# EAGLE design E2_Transistor_Blank (EAGLE 9.3.0)
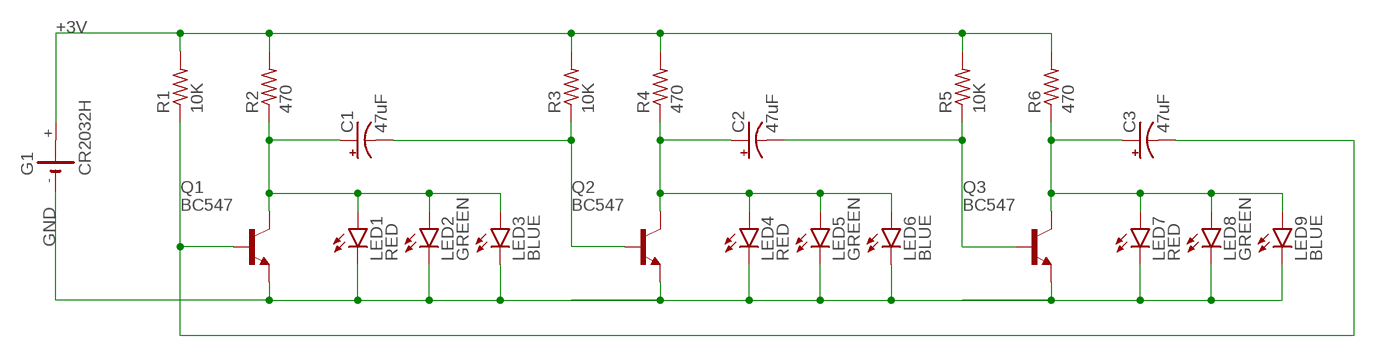
[diagram p0: schematic, sheet 1]

## Parts
C1  47uF  CPOL-USE1.8-4  [E1,8-4]
C2  47uF  CPOL-USE1.8-4  [E1,8-4]
C3  47uF  CPOL-USE1.8-4  [E1,8-4]
G1  CR2032H  [CR2032H]
LED1  RED  LED5MM  [LED5MM]
LED2  GREEN  LED5MM  [LED5MM]
LED3  BLUE  LED5MM  [LED5MM]
LED4  RED  LED5MM  [LED5MM]
LED5  GREEN  LED5MM  [LED5MM]
LED6  BLUE  LED5MM  [LED5MM]
LED7  RED  LED5MM  [LED5MM]
LED8  GREEN  LED5MM  [LED5MM]
LED9  BLUE  LED5MM  [LED5MM]
Q1  BC547  [TO92]
Q2  BC547  [TO92]
Q3  BC547  [TO92]
R1  10K  R-US_0309/12  [0309/12]
R2  470  R-US_0309/12  [0309/12]
R3  10K  R-US_0309/12  [0309/12]
R4  470  R-US_0309/12  [0309/12]
R5  10K  R-US_0309/12  [0309/12]
R6  470  R-US_0309/12  [0309/12]

## Nets
+3V: G1.+ R1.2 R2.2 R3.2 R4.2 R5.2 R6.2
GND: G1.- LED1.K(C) LED2.K(C) LED3.K(C) LED4.K(C) LED5.K(C) LED6.K(C) LED7.K(C) LED8.K(C) LED9.K(C) Q1.1(E) Q2.1(E) Q3.1(E)
N$1: C1.+ LED1.A LED2.A LED3.A Q1.3(C) R2.1
N$4: C1.- Q2.2(B) R3.1
N$6: C2.+ LED4.A LED5.A LED6.A Q2.3(C) R4.1
N$7: C3.+ LED7.A LED8.A LED9.A Q3.3(C) R6.1
N$8: C3.- Q1.2(B) R1.1
N$9: C2.- Q3.2(B) R5.1
Unconnected: G1.+@1(+)

## Library data of the parts
C1-C3 = rcl:CPOL-US: POLARIZED CAPACITOR, American symbol; SPICEPREFIX: C
G1 = battery:CR2032H: LI BATTERY Varta
LED1-LED9 = led:LED: LED OSRAM: - CHIPLED LG R971, LG N971, LY N971, LG Q971, LY Q971, LO R971, LY R971 LH N974, LH R974 LS Q976, LO Q976, LY Q976 LO Q996 - Hyper CHIPLED LW Q18S LB Q993, LB Q99A, LB R99A - SideLED LS A670, LO A670, LY A670, LG A670, LP A670 LB A673, LV A673, LT A673, LW A673 LH A674 LY A675 LS A676, LA A676, LO A676, LY A676, LW A676 LS A679, LY A679, LG A679 - Hyper Micro SIDELED® LS Y876, LA Y876, LO Y876, LY Y876 LT Y87S - SmartLED LW L88C, LW L88S LB L89C, LB L89S, LG L890 LS L89K, LO L89K, LY L89K LS L896, LA L896, LO L896, LY L896 - TOPLED LS T670, LO T670, LY T670, LG T670, LP T670 LSG T670, LSP T670, LSY T670, LOP T670, LYG T670 LG T671, LOG T671, LSG T671 LB T673, LV T673, LT T673, LW T673 LH T674 LS T676, LA T676, LO T676, LY T676, LB T676, LH T676, LSB T676, LW T676 LB T67C, LV T67C, LT T67C, LS T67K, LO T67K, LY T67K, LW E67C LS E67B, LA E67B, LO E67B, LY E67B, LB E67C, LV E67C, LT E67C LW T67C LS T679, LY T679, LG T679 LS T770, LO T770, LY T770, LG T770, LP T770 LB T773, LV T773, LT T773, LW T773 LH T774 LS E675, LA E675, LY E675, LS T675 LS T776, LA T776, LO T776, LY T776, LB T776 LHGB T686 LT T68C, LB T68C - Hyper Mini TOPLED® LB M676 - Mini TOPLED Santana® LG M470 LS M47K, LO M47K, LY M47K Source: http://www.osram.convergy.de LUXEON: - LUMILED® LXK2-PW12-R00, LXK2-PW12-S00, LXK2-PW14-U00, LXK2-PW14-V00 LXK2-PM12-R00, LXK2-PM12-S00, LXK2-PM14-U00 LXK2-PE12-Q00, LXK2-PE12-R00, LXK2-PE12-S00, LXK2-PE14-T00, LXK2-PE14-U00 LXK2-PB12-K00, LXK2-PB12-L00, LXK2-PB12-M00, LXK2-PB14-N00, LXK2-PB14-P00, LXK2-PB14-Q00 LXK2-PR12-L00, LXK2-PR12-M00, LXK2-PR14-Q00, LXK2-PR14-R00 LXK2-PD12-Q00, LXK2-PD12-R00, LXK2-PD12-S00 LXK2-PH12-R00, LXK2-PH12-S00 LXK2-PL12-P00, LXK2-PL12-Q00, LXK2-PL12-R00 Source: www.luxeon.com KINGBRIGHT: KA-3528ASYC Source: www.kingbright.com
Q1-Q3 = transistor-npn:BC547*: NPN Transistor
R1-R6 = rcl:R-US_: RESISTOR, American symbol; SPICEPREFIX: R

## Board
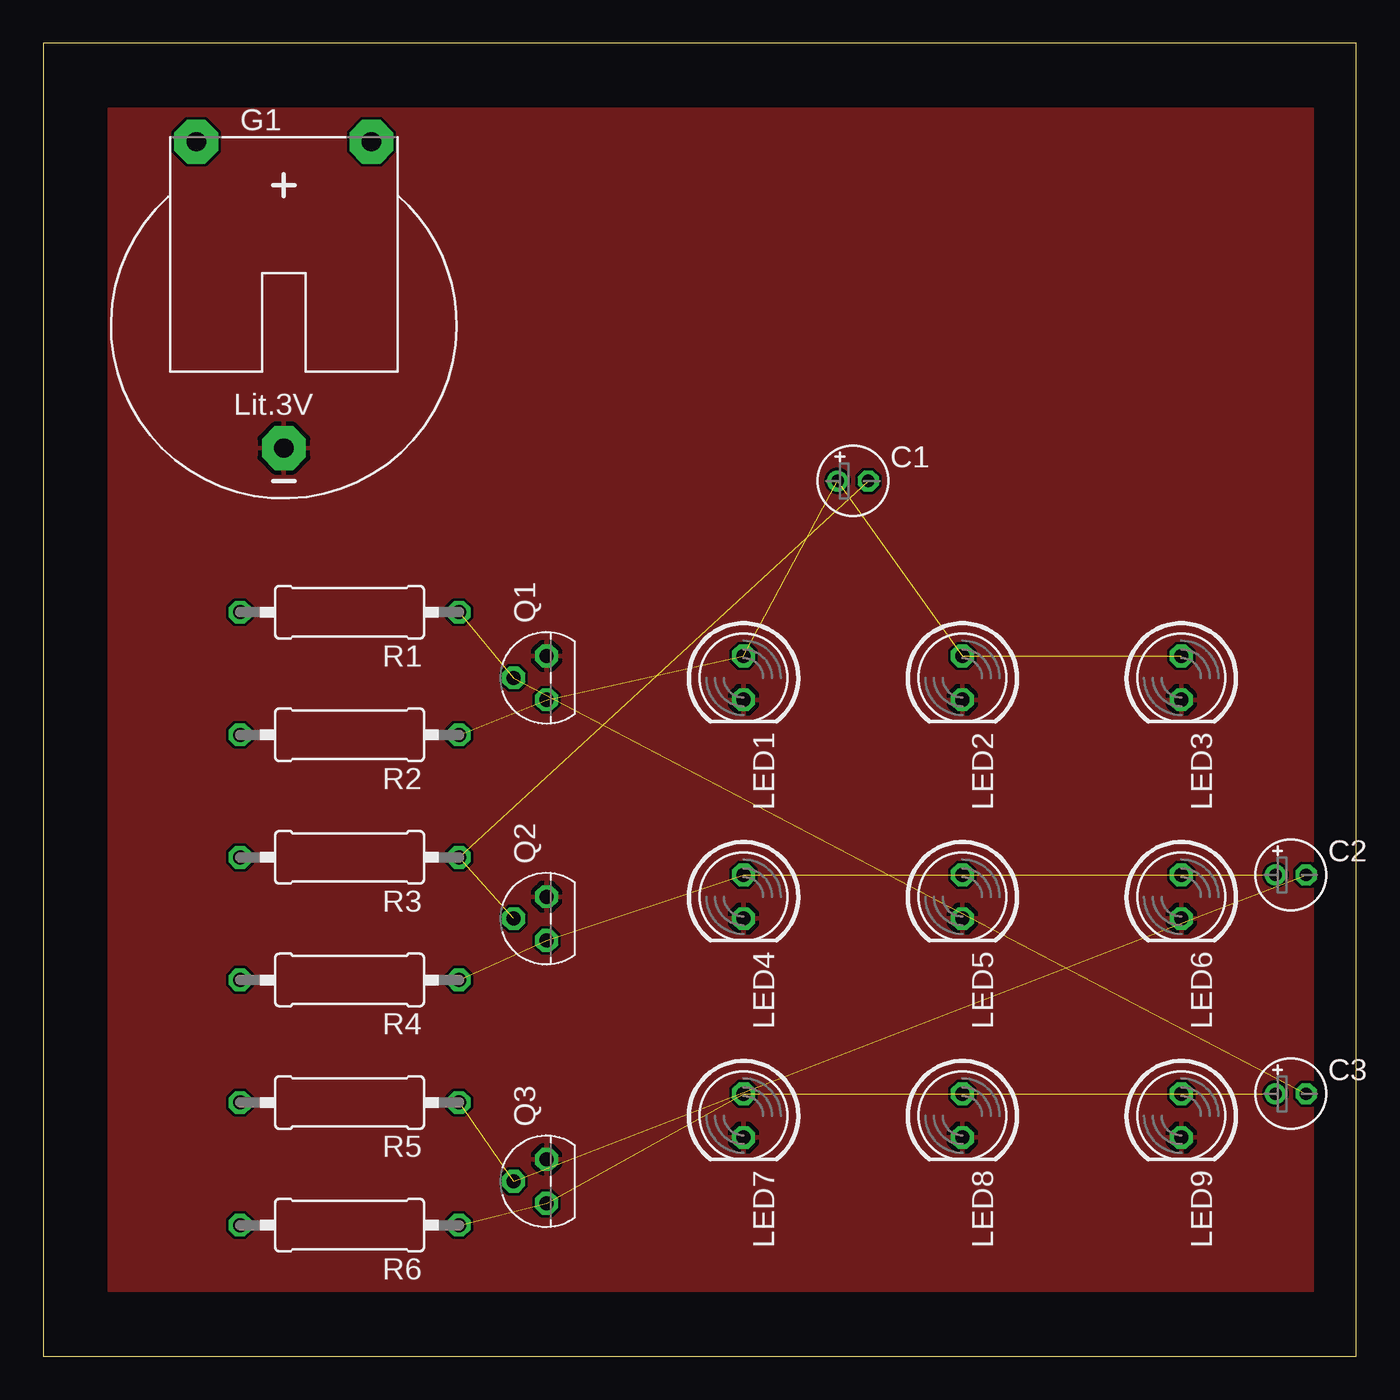
[diagram p1: board, top side]
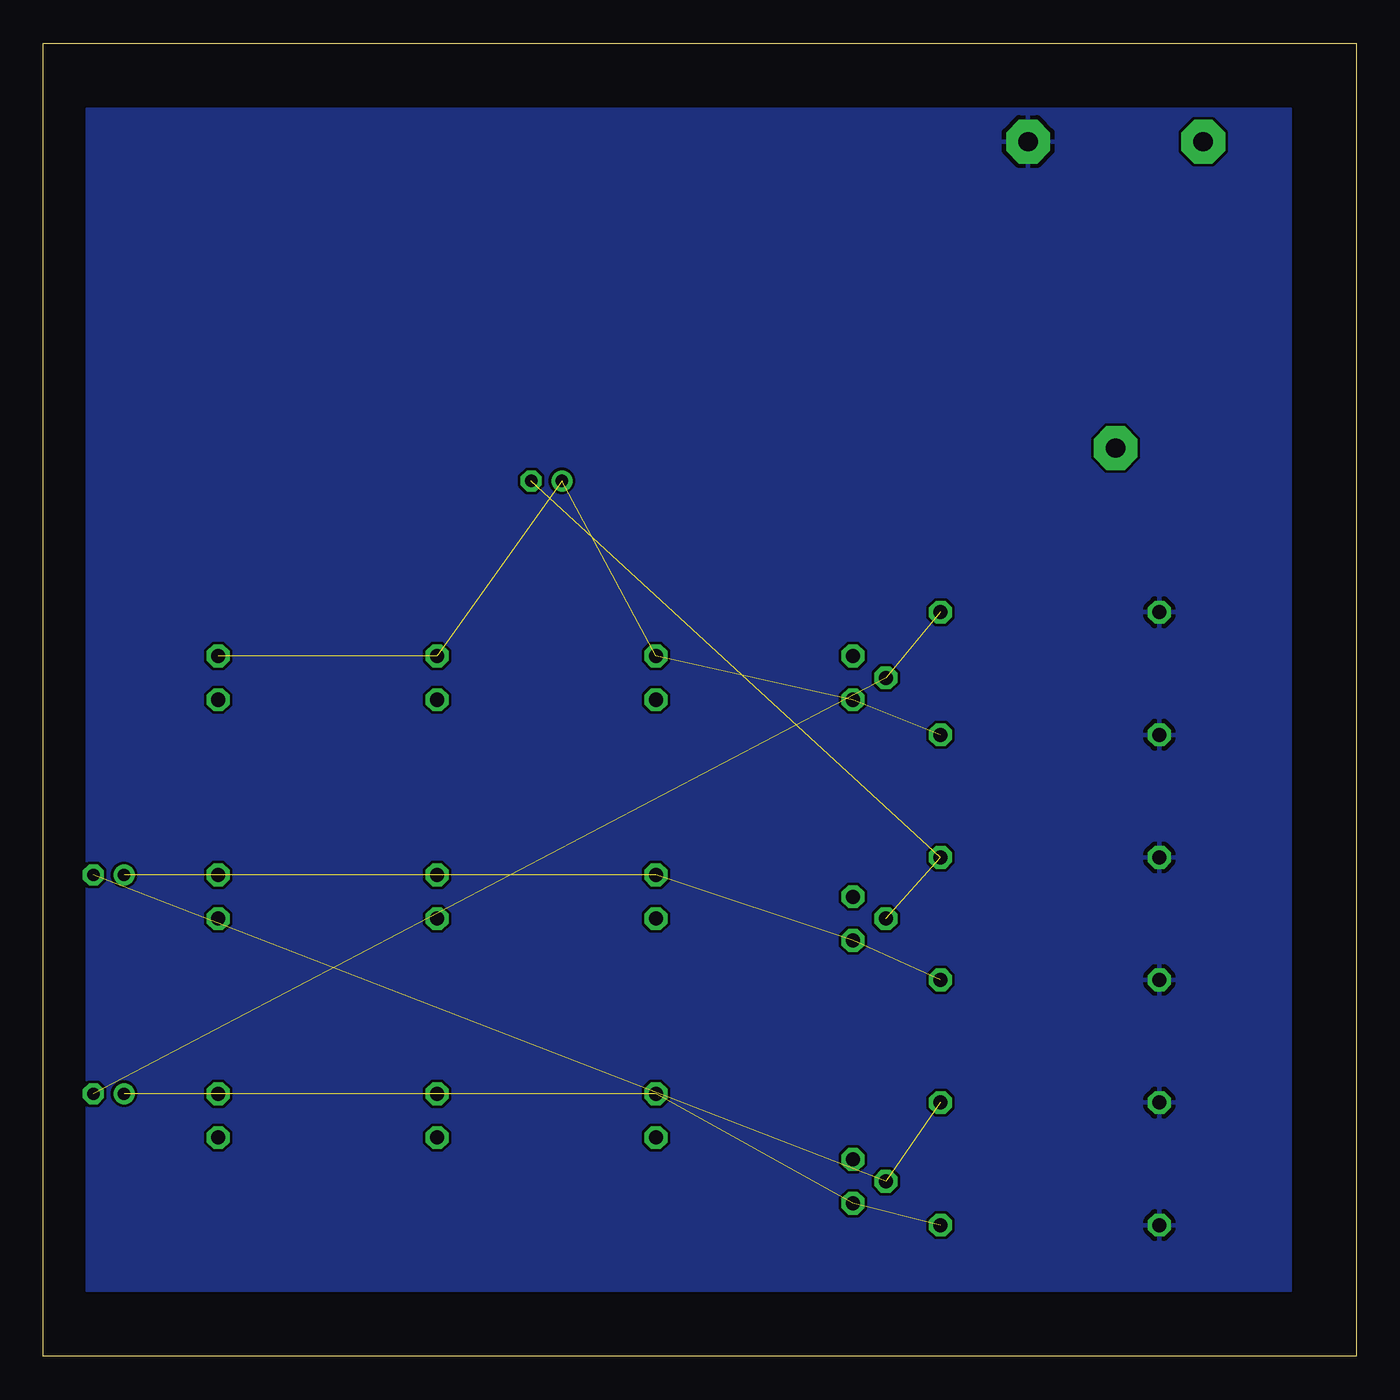
[diagram p2: board, bottom side, seen from below]

Size 76.2 x 76.2 mm. Coordinates in mm from the lower left corner, seen from the top.
Outline: 0,0 76.2,0 76.2,76.2 0,76.2 0,0
Copper layers (1*16): Top 0.035mm / dielectric 1.5mm / Bottom 0.035mm
Design rules "default": minimum track width 6mil, minimum drill 0.35mm, track to track 6mil, track to pad 6mil, pad to pad 6mil, via to via 6mil, smd to smd 6mil, copper to edge 40mil, drill to drill 6mil, minimum pad ring 10mil, minimum via ring 8mil, stop-mask expansion 4mil, vias tented up to drill 0mil, thermal gap 10mil

### Footprints (pad centres in the part's own frame; a part is rotated, then mirrored left to right if it is on the bottom)
E1,8-4 = drill 0.711 pad 1.168: + -0.889,0 | drill 0.711 pad 1.168 octagon: - 0.889,0
CR2032H = drill 1.118 pad 2.54 octagon: + 5.08,10.795; +@1 -5.08,10.795; - 0,-6.985
LED5MM = drill 0.813 octagon: A -1.27,0; K 1.27,0
TO92 = drill 0.813 octagon: 1 1.27,0; 2 0,1.905; 3 -1.27,0
0309/12 = drill 0.813 octagon: 1 -6.35,0; 2 6.35,0

### Placement (x,y rotation side)
C1  46.99,50.8 0 top
C2  72.39,27.94 0 top
C3  72.39,15.24 0 top
G1  13.97,59.69 0 top
LED1  40.64,39.37 270 top
LED2  53.34,39.37 270 top
LED3  66.04,39.37 270 top
LED4  40.64,26.67 270 top
LED5  53.34,26.67 270 top
LED6  66.04,26.67 270 top
LED7  40.64,13.97 270 top
LED8  53.34,13.97 270 top
LED9  66.04,13.97 270 top
Q1  29.21,39.37 90 top
Q2  29.21,25.4 90 top
Q3  29.21,10.16 90 top
R1  17.78,43.18 180 top
R2  17.78,36.07 180 top
R3  17.78,28.96 180 top
R4  17.78,21.84 180 top
R5  17.78,14.73 180 top
R6  17.78,7.62 180 top

### Tracks (layer width: path | path; a pad name or v marks a point on that pad's centre or on a via)
+3V
  pour Bottom: 3.81,72.39 73.66,72.39 73.66,3.81 3.81,3.81
GND
  pour Top: 3.81,71.12 3.81,3.81 73.66,3.81 73.66,72.39 3.81,72.39
N$1  (5 unrouted)
N$4  (2 unrouted)
N$6  (5 unrouted)
N$7  (5 unrouted)
N$8  (2 unrouted)
N$9  (2 unrouted)